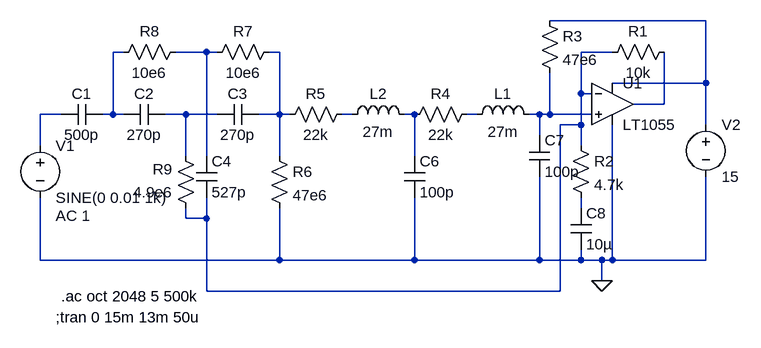
[diagram p0: schematic VLFWhistlerAmplifier.asc]
VLFWhistlerAmplifier.asc, the LTspice schematic file:
Version 4
SHEET 1 880 680
WIRE 720 -80 480 -80
WIRE -176 -32 -192 -32
WIRE -48 -32 -96 -32
WIRE -32 -32 -48 -32
WIRE 64 -32 48 -32
WIRE 576 -32 528 -32
WIRE 720 16 720 -80
WIRE 720 16 576 16
WIRE 528 32 528 -32
WIRE 544 32 528 32
WIRE 656 48 656 -32
WIRE 656 48 608 48
WIRE -272 64 -304 64
WIRE -192 64 -192 -32
WIRE -192 64 -208 64
WIRE -176 64 -192 64
WIRE -80 64 -112 64
WIRE -32 64 -80 64
WIRE 64 64 64 -32
WIRE 64 64 32 64
WIRE 80 64 64 64
WIRE 176 64 160 64
WIRE 272 64 256 64
WIRE 368 64 352 64
WIRE 464 64 448 64
WIRE 480 64 480 0
WIRE 480 64 464 64
WIRE 544 64 480 64
WIRE 528 80 528 32
WIRE 528 80 496 80
WIRE 720 80 720 16
WIRE 464 96 464 64
WIRE -304 112 -304 64
WIRE 528 112 528 80
WIRE -80 128 -80 64
WIRE -48 128 -48 -32
WIRE 64 128 64 64
WIRE 272 128 272 64
WIRE 528 208 528 192
WIRE -80 224 -80 208
WIRE -48 224 -48 192
WIRE -48 224 -80 224
WIRE -304 288 -304 192
WIRE 64 288 64 208
WIRE 64 288 -304 288
WIRE 272 288 272 192
WIRE 272 288 64 288
WIRE 464 288 464 160
WIRE 464 288 272 288
WIRE 528 288 528 272
WIRE 528 288 464 288
WIRE 560 288 528 288
WIRE 576 288 576 80
WIRE 576 288 560 288
WIRE 720 288 720 160
WIRE 720 288 576 288
WIRE 560 320 560 288
WIRE -48 336 -48 224
WIRE 496 336 496 80
WIRE 496 336 -48 336
FLAG 560 320 0
SYMBOL Opamps\\LT1055 576 -16 R0
SYMATTR InstName U1
SYMBOL res 560 -16 R270
WINDOW 0 32 56 VTop 2
WINDOW 3 0 56 VBottom 2
SYMATTR InstName R1
SYMATTR Value 10k
SYMBOL res 512 96 R0
SYMATTR InstName R2
SYMATTR Value 4.7k
SYMBOL res 464 -96 R0
SYMATTR InstName R3
SYMATTR Value 47e6
SYMBOL ind 352 80 R270
WINDOW 0 32 56 VTop 2
WINDOW 3 5 56 VBottom 2
SYMATTR InstName L1
SYMATTR Value 27m
SYMBOL ind 160 80 R270
WINDOW 0 32 56 VTop 2
WINDOW 3 5 56 VBottom 2
SYMATTR InstName L2
SYMATTR Value 27m
SYMBOL res 256 80 R270
WINDOW 0 32 56 VTop 2
WINDOW 3 0 56 VBottom 2
SYMATTR InstName R4
SYMATTR Value 22k
SYMBOL res 64 80 R270
WINDOW 0 32 56 VTop 2
WINDOW 3 0 56 VBottom 2
SYMATTR InstName R5
SYMATTR Value 22k
SYMBOL res 48 112 R0
SYMATTR InstName R6
SYMATTR Value 47e6
SYMBOL res -48 -16 R270
WINDOW 0 32 56 VTop 2
WINDOW 3 0 56 VBottom 2
SYMATTR InstName R7
SYMATTR Value 10e6
SYMBOL res -192 -16 R270
WINDOW 0 32 56 VTop 2
WINDOW 3 0 56 VBottom 2
SYMATTR InstName R8
SYMATTR Value 10e6
SYMBOL voltage -304 96 R0
WINDOW 123 24 124 Left 2
WINDOW 39 0 0 Left 2
SYMATTR InstName V1
SYMATTR Value SINE(0 0.01 1k)
SYMATTR Value2 AC 1
SYMBOL cap -208 48 R90
WINDOW 0 0 32 VBottom 2
WINDOW 3 32 32 VTop 2
SYMATTR InstName C1
SYMATTR Value 500p
SYMBOL cap -112 48 R90
WINDOW 0 0 32 VBottom 2
WINDOW 3 32 32 VTop 2
SYMATTR InstName C2
SYMATTR Value 270p
SYMBOL cap 32 48 R90
WINDOW 0 0 32 VBottom 2
WINDOW 3 32 32 VTop 2
SYMATTR InstName C3
SYMATTR Value 270p
SYMBOL cap -64 128 R0
SYMATTR InstName C4
SYMATTR Value 527p
SYMBOL res -64 224 R180
WINDOW 0 36 76 Left 2
WINDOW 3 36 40 Left 2
SYMATTR InstName R9
SYMATTR Value 4.9e6
SYMBOL cap 256 128 R0
SYMATTR InstName C6
SYMATTR Value 100p
SYMBOL cap 448 96 R0
SYMATTR InstName C7
SYMATTR Value 100p
SYMBOL cap 512 208 R0
SYMATTR InstName C8
SYMATTR Value 10µ
SYMBOL voltage 720 64 R0
SYMATTR InstName V2
SYMATTR Value 15
TEXT -272 344 Left 2 !.ac oct 2048 5 500k
TEXT -280 376 Left 2 !;tran 0 15m 13m 50u

The netlist it stands for:
* VLFWhistlerAmplifier.asc
XU1 N012 N005 N001 0 N006 LT1055  ; pins In+ In- V+ V- OUT
R1 N005 N006 10k
R2 N005 N013 4.7k
R3 N001 N012 47e6
L1 N011 N012 27m
L2 N009 N010 27m
R4 N010 N011 22k
R5 N004 N009 22k
R6 N004 0 47e6
R7 N003 N004 10e6
R8 N002 N003 10e6
V1 N007 0 SINE(0 0.01 1k) AC 1
C1 N002 N007 500p
C2 N008 N002 270p
C3 N004 N008 270p
C4 N003 N005 527p
R9 N005 N008 4.9e6
C6 N010 0 100p
C7 N012 0 100p
C8 N013 0 10µ
V2 N001 0 15
.ac oct 2048 5 500k
;tran 0 15m 13m 50u
.backanno
.end